# Altium schematic sheet Neg5V0Reg.SchDoc
size A4
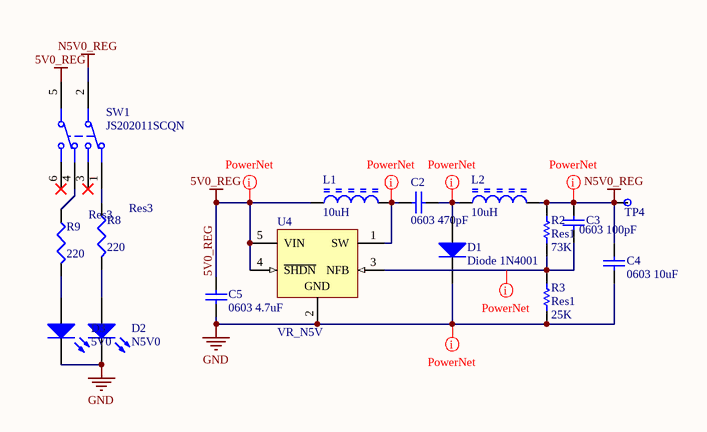
[diagram p0: Neg5V0Reg.SchDoc]

## Parts
C2  0603 470pF  [CAPC1608X90X35LL10T15]
C3  0603 100pF  [CAPC1608X90X35LL10T15]
C4  0603 10uF  [CAPC1608X90X35LL10T15]
C5  0603 4.7uF  [CAPC1608X90X35LL10T15]
D1  Diode 1N4001  [DO-41]
D2  N5V0  [LTST-C171TBKT]
D3  5V0  [LTST-C171TBKT]
L1  10uH  [BOUR-CM322522_V]
L2  10uH  [BOUR-CM322522_V]
R2  Res1  value 73K  [RESC1608X06N_0603]
R3  Res1  value 25K  [RESC1608X06N_0603]
R8  Res3  value 220  [RESC1608X06N_0603]
R9  Res3  value 220  [RESC1608X06N_0603]
SW1  JS202011SCQN  [CKCP-JS202011SCQN-6_V]
TP4  N5V0_REG  [50_MIL_PAD]  (value not drawn)
U4  VR_N5V  [LT-S5-5-SOT-23_L]

## Nets
5V0_REG: C5.2 L1.1 SW1.5(COM) U4.4(~{SHDN}) U4.5(VIN)
GND: C4.1 C5.1 D1.2(K) D2.2(K) D3.2(K) R3.1 U4.2(GND)
N5V0_REG: C3.2 C4.2 L2.2 R2.2 SW1.2(COM) TP4.1
NetC2_1: C2.1 L1.2 U4.1(SW)
NetC2_2: C2.2 D1.1(A) L2.1
NetC3_1: C3.1 R2.1 R3.2 U4.3(NFB)
NetD2_1: D2.1(A) R8.2
NetD3_1: D3.1(A) R9.2
NetR8_1: R8.1 SW1.1
NetR9_1: R9.1 SW1.4

Not connected (* = marked no-connect by the designer): SW1 3* 6*

## Layout directives
mark named PowerNet: 5V0_REG, GND, N5V0_REG, NetC2_1, NetC2_2, NetC3_1

## Library data of the parts
C2-C5 = CMP-2006-02523-1: Part Number: GRM188R61E475KE11D; Manufacturer: Murata
D1 = Diode 1N4001: 1 Amp General Purpose Rectifier; Published: 8-Jun-2000; LatestRevisionDate: 17-Jul-2002; LatestRevisionNote: Re-released for DXP Platform.; DatasheetVersion: 1998; PackageVersion: Aug-1999; PackageReference: DO-41; Publisher: Altium Limited; PackageDescription: Diode, Axial; Body 5.2 x 2.7 mm (LxDia. max), Lead Dia. 0.86 mm (max); Code_JEDEC: DO-204-AL; ComponentLink1Description: Manufacturer Link; ComponentLink1URL: http://www.fairchildsemi.com/; ComponentLink2Description: Datasheet; ComponentLink2URL: http://www.fairchildsemi.com/ds/1N%2F1N4001.pdf
D2 D3 = Blue LED
L1 L2 = CMP-1747-00008-1: Chip Inductor / , 10 uH, +/- 10%, -40 to 125 degC, 1210 (3225 Metric), RoHS, Tape and Reel; Current Rating: 1.5 A; Colour: White; Gender: Female; Connector Type: USB; Min Operating Temperature: -55 degC; ComponentLink2Description: Datasheet; Packaging: Tray; Contact Material: Bronze; ComponentLink1Description: Manufacturer URL; PackageDescription: 2-Pin Surface Mount Device, Body 3.2 x 2.5 mm; Contact Plating: Gold; Max Operating Temperature: 85 degC; ComponentLink2URL: http://www.bourns.com/docs/Product-Datasheets/cm322522.pdf; PackageReference: 1210; Radiation Hardening: No; DatasheetVersion: Aug-14; Package Quantity: 100; Pins: 4; Mount: Through Hole; Lead Pitch: 2.5 mm; ComponentLink1URL: http://www.bourns.com/; Height: 15.9 mm; RoHSCompliant: true; Width: 11.15 mm
R2 R3 = Res1: Resistor; Published: 8-Jun-2000; LatestRevisionDate: 17-Jul-2002; LatestRevisionNote: Re-released for DXP Platform.; PackageReference: AXIAL-0.3; Publisher: Altium Limited; PackageDescription: Axial Device, Thru-Hole; 2 Leads; 0.3 in Pin Spacing
R8 R9 = Res3: Resistor; Published: 8-Jun-2000; LatestRevisionDate: 29-May-2009; LatestRevisionNote: IPC-7351 Footprint Added.; PackageReference: J1-0603; Publisher: Altium Limited; PackageDescription: Chip Resistor
SW1 = CMP-2000-05087-1: Switch Slide DPDT, 0.3 A, 6 V, -40 to 85 degC, 6-Pin SMD, RoHS, Tape and Reel; Manufacturer: C&K Components; Contact Rating @ Voltage: 0.3@6VDCA; COO: US; Maximum DC Voltage Rating: 6V; Minimum Insulation Resistance: 100MOhm; Actuator Color: Black; Body Orientation: Straight; Actuator Material: Nylon4/6; Dielectric Strength: 500VAC; Maximum Contact Resistance: 70mOhm; Actuator Style: TopSlide; Electrical Life: 15000Cycles; Seal Location: N/A; Base Material: N/A; Mechanical Life: N/A; Switch Configuration: N/A; HTS: 8536509050; Contact Material: CopperAlloy; Supplier Standard Pack: 5,000; Manufacturer URL: http://www.ckswitches.com; Supplier: C&KComponents; Datasheet URL: http://datasheet.octopart.com/JS202011SCQN-C%26K-Components-datasheet-62100994.pdf; Housing Material: Nylon4/6; Product Weight: N/A; Dimension: 9x7.5x5.5mm; Maximum AC Voltage Rating: N/A; ECCN: EAR99; Contact Plating: Silver; Pole Throw Configuration: DPDT; Packaging: TapeandReel; Part No: JS202011SCQN; Datasheet Version: Sep-15; Seal Description: N/A; RoHS: Yes; Mounting: SurfaceMount,GullWing; Family: JS; Type: Sub-Miniature; Operating Temperature: -40to85C
TP4 = TestPt
U4 = CMP-0491-01503-1: Micropower Inverting DC/DC Converter, 5-pin SOT23 (S5-5), -40 to 85 degC, Pb-Free, Mini Tape and Reel; PartNumber: LT1617ES5#TRMPBF; Manufacturer: Linear Technology; Number of Outputs: 1; RoHS: TRUE; ComponentLink3URL: http://cds.linear.com/docs/en/datasheet/17278fb.pdf; ComponentLink2Description: Datasheet; Packing: Mini Tape and Reel; PackageReference: S5-5; ComponentLink1URL: http://www.linear.com/; Mounting Technology: Surface Mount; PackageDescription: 5-Pin Plastic SOT-23, Body 1.625 x 2.90 mm, Pitch 0.95 mm; ComponentLink3Description: Package Specification; ComponentLink2URL: http://cds.linear.com/docs/en/datasheet/16171f.pdf; PackageVersion: Aug-07; ComponentLink1Description: Manufacturer URL